# Altium schematic sheet Unfolder.SchDoc: <Document>
size Letter; Engineer: <Engineer>; Organization: UPEL; Address1: USU Power Electronics Lab; Address2: USTAR Building 620, RM 118; Address3: 1600 N 620 E; Address4: North Logan, UT 84341; DocumentNumber: 7; Revision: v1; SheetNumber: 7; SheetTotal: 16; ProjectName: <Project>
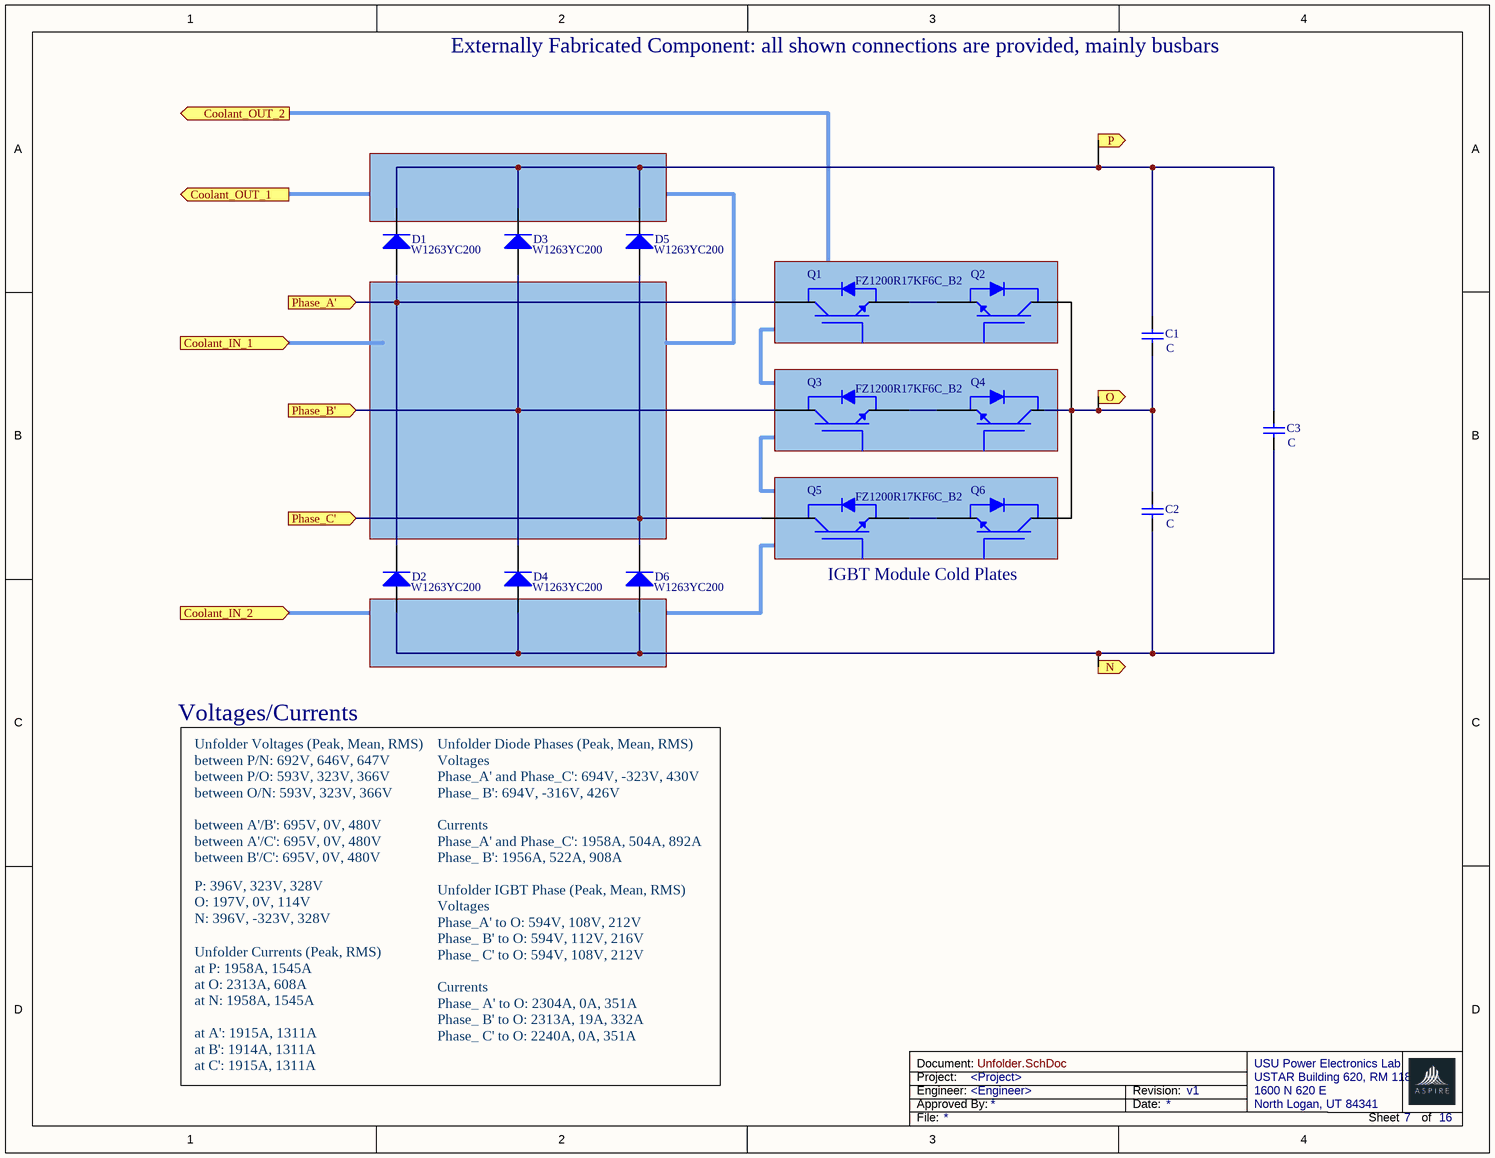
[diagram p0: Unfolder.SchDoc]

## Parts
C1  value C  [RAD-0.3]  (hidden comment: Cap)
C2  value C  [RAD-0.3]  (hidden comment: Cap)
C3  value C  [RAD-0.3]  (hidden comment: Cap)
D1  Diode  [SMC]  (value not drawn)
D2  Diode  [SMC]  (value not drawn)
D3  Diode  [SMC]  (value not drawn)
D4  Diode  [SMC]  (value not drawn)
D5  Diode  [SMC]  (value not drawn)
D6  Diode  [SMC]  (value not drawn)
Q1  IGBT_Module_1  (value not drawn)
Q2  IGBT_Module_2  (value not drawn)
Q3  IGBT_Module_1  (value not drawn)
Q4  IGBT_Module_2  (value not drawn)
Q5  IGBT_Module_1  (value not drawn)
Q6  IGBT_Module_2  (value not drawn)

## Ports
Coolant_IN_1 (in), Coolant_IN_2 (in), Coolant_OUT_1 (out), Coolant_OUT_2 (out), N (out), O (out), P (out), Phase_A' (in), Phase_B' (in), Phase_C' (in)

## Nets
N: C2.2 C3.2 D2.1(A) D4.1(A) D6.1(A) ; port N
O: C1.2 C2.1 ; port O
P: C1.1 C3.1 D1.2(K) D3.2(K) D5.2(K) ; port P
Phase_A': D1.1(A) D2.2(K) ; port Phase_A'
Phase_B': D3.1(A) D4.2(K) ; port Phase_B'
Phase_C': D5.1(A) D6.2(K) ; port Phase_C'

Not connected (* = marked no-connect by the designer): Q1 1(0) 2(1); Q2 1(2) 2(3); Q3 1(0) 2(1); Q4 1(2) 2(3); Q5 1(0) 2(1); Q6 1(2) 2(3)

## Notes on the sheet
- Externally Fabricated Component: all shown connections are provided, mainly busbars
- (near D1) W1263YC200
- (near D3) W1263YC200
- (near D5) W1263YC200
- (near Q1) Q1
- FZ1200R17KF6C_B2
- (near Q3) Q3
- (near Q5) Q5
- (near D2) W1263YC200
- (near D4) W1263YC200
- (near D6) W1263YC200
- IGBT Module Cold Plates
- Voltages/Currents
- Unfolder Voltages (Peak, Mean, RMS)
  between P/N: 692V, 646V, 647V
  between P/O: 593V, 323V, 366V
  between O/N: 593V, 323V, 366V
  between A'/B': 695V, 0V, 480V
  between A'/C': 695V, 0V, 480V
  between B'/C': 695V, 0V, 480V
- P: 396V, 323V, 328V                       O: 197V, 0V, 114V                         N: 396V, -323V, 328V
- Unfolder Diode Phases (Peak, Mean, RMS)
  Voltages
  Phase_A' and Phase_C': 694V, -323V, 430V
  Phase_ B': 694V, -316V, 426V
  Currents
  Phase_A' and Phase_C': 1958A, 504A, 892A
  Phase_ B': 1956A, 522A, 908A
  Unfolder IGBT Phase (Peak, Mean, RMS)
  Voltages
  Phase_A' to O: 594V, 108V, 212V
  Phase_ B' to O: 594V, 112V, 216V
  Phase_ C' to O: 594V, 108V, 212V
  Currents
  Phase_ A' to O: 2304A, 0A, 351A
  Phase_ B' to O: 2313A, 19A, 332A
  Phase_ C' to O: 2240A, 0A, 351A
- Unfolder Currents (Peak, RMS)
  at P: 1958A, 1545A
  at O: 2313A, 608A
  at N: 1958A, 1545A
  at A': 1915A, 1311A
  at B': 1914A, 1311A
  at C': 1915A, 1311A
- Project:
- Engineer:
- Document:
- Approved By:
- Date:
- Revision:
- File:
- Sheet
- of

## Library data of the parts
C1-C3 = Cap: Capacitor; Published: 8-Jun-2000; LatestRevisionDate: 17-Jul-2002; LatestRevisionNote: Re-released for DXP Platform.; PackageReference: RAD-0.3; Publisher: Altium Limited; PackageDescription: Radial Cap, Thru-Hole; 2 Leads; 0.3 in Pin Spacing
D1-D6 = Diode: Default Diode; Published: 8-Jun-2000; LatestRevisionDate: 17-Jul-2002; LatestRevisionNote: Re-released for DXP Platform.; PackageVersion: Sep-1996; PackageReference: SMC; Publisher: Altium Limited; PackageDescription: DO-214-AB/SMC; 2 C-Bend Leads; Body 7.9 x 5.9 mm, inc. leads (LxW); Code_JEDEC: DO-214-AB